# EAGLE design glove_motor_dr (EAGLE 9.6.2)
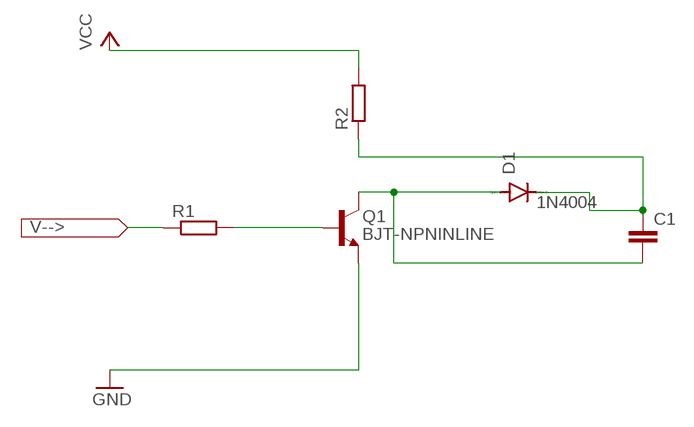
[diagram p0: schematic, sheet 1]

## Parts
C1  C-EU025-024X044  [C025-024X044]
D1  1N4004  [DO41-10]
Q1  BJT-NPNINLINE  [TO92I]
R1  R-EU_0207/7  [0207/7]
R2  R-EU_0207/7  [0207/7]

## Nets
GND: Q1.E
MOTOR: C1.2 D1.A Q1.C
N$1: C1.1 D1.C R2.1
N$2: R1.1
N$4: Q1.B R1.2
VCC: R2.2

## Library data of the parts
C1 = resistor:C-EU: CAPACITOR, European symbol
D1 = diode:1N4004: DIODE general purpose rectifier, 1 A
Q1 = bt_transistor:BJT-NPN: NPN Transistor Small signal NPN Bipolar Junction Transistor (BJT). Use this device to represent any of a number of such transistors with similar package and pinout: 2N4401, 2N3904, 2N2222, etc.
R1 R2 = resistor:R-EU_: RESISTOR, European symbol

## Board
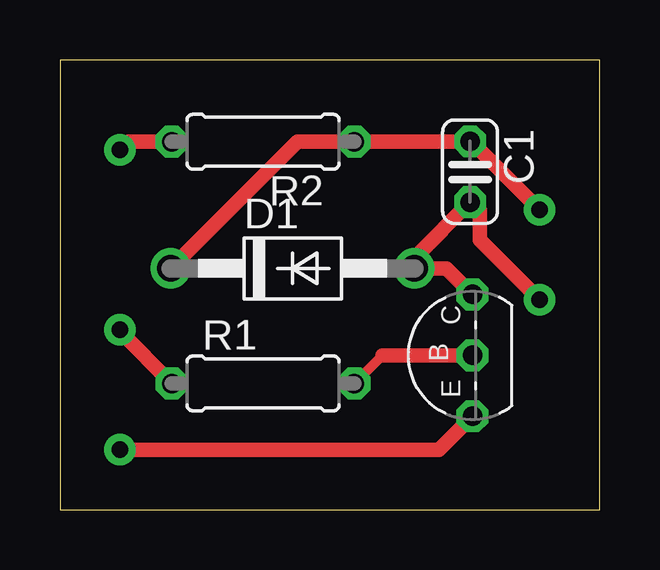
[diagram p1: board, top side]
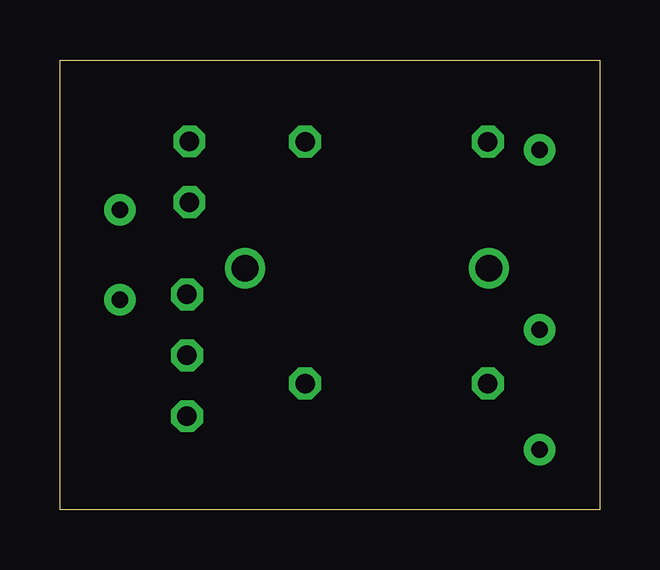
[diagram p2: board, bottom side, seen from below]

Size 22.5 x 18.75 mm. Coordinates in mm from the lower left corner, seen from the top.
Outline: 0,0 22.5,0 22.5,18.75 0,18.75 0,0
Copper layers (1*16): Top 0.035mm / dielectric 1.5mm / Bottom 0.035mm
Design rules "default": minimum track width 6mil, minimum drill 0.35mm, track to track 6mil, track to pad 6mil, pad to pad 6mil, via to via 6mil, smd to smd 6mil, copper to edge 40mil, drill to drill 6mil, minimum pad ring 10mil, minimum via ring 8mil, stop-mask expansion 4mil, vias tented up to drill 0mil, thermal gap 10mil

### Footprints (pad centres in the part's own frame; a part is rotated, then mirrored left to right if it is on the bottom)
C025-024X044 = drill 0.813 octagon: 1 -1.27,0; 2 1.27,0
DO41-10 = drill 1.118: A 5.08,0; C -5.08,0
TO92I = drill 0.813 octagon: B 0,0; C 2.54,0; E -2.54,0
0207/7 = drill 0.813 octagon: 1 -3.81,0; 2 3.81,0

### Placement (x,y rotation side)
C1  17.1,14.09 270 top
D1  9.7,10.06 0 top
Q1  17.2,6.43 90 top
R1  8.47,5.26 0 top
R2  8.47,15.34 180 top

### Tracks (layer width: path | path; a pad name or v marks a point on that pad's centre or on a via)
GND
  Top 0.61: Q1.E 15.81,2.5 2.5,2.5
MOTOR  (via drill 0.35)
  Top 0.61: C1.2 14.86,10.58 v14.86,10.06 | Q1.C 16.11,10.06 D1.A
  Bottom 0.406: v14.86,10.06 D1.A
N$1
  Top 0.61: R2.1 12.3,15.36 | D1.C 9.9,15.34 R2.1 | R2.1 17.08,15.34 C1.1
N$2
  Top 0.61: R1.1 2.5,7.42 2.5,7.5
N$3  (via drill 0.7 pad 1.3)
  other vias: 2.5,15
N$4
  Top 0.406: 13.45,6.43 R1.2
  Top 0.61: Q1.B 13.45,6.43
N$5  (via drill 0.7 pad 1.3)
  other vias: 2.5,7.5
N$6  (via drill 0.7 pad 1.3)
  other vias: 2.5,2.5
N$7  (via drill 0.7 pad 1.3)
  Top 0.61: v20,8.75 17.5,11.25 17.5,12.5
N$8  (via drill 0.7 pad 1.3)
  Top 0.61: v20,12.5 17.5,15
VCC
  Top 0.61: R2.2 2.84,15.34 2.5,15